# EAGLE design Maxim 7219 LED display - Sparkfun YoungSun 4 digit 7 segment CA v.1.1 (EAGLE 6.5.0)
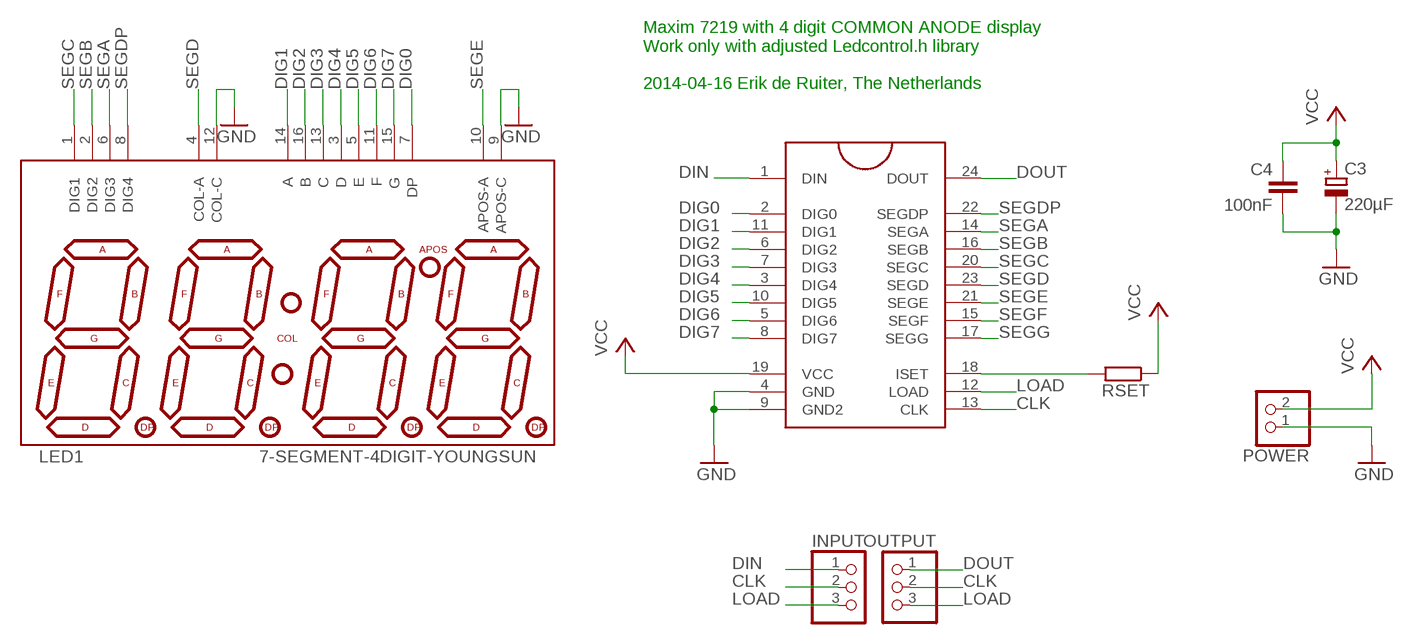
[diagram p0: schematic, sheet 1]

## Parts
C3  220µF  CPOL-EUE3.5-8  [E3,5-8]
C4  100nF  C-EU050-025X075  [C050-025X075]
INPUT  PINHD-1X3  [1X03]
LED1  7-SEGMENT-4DIGIT-YOUNGSUN  [7-SEGMENT-4DIGIT-YOUNGSUN]
OUTPUT  PINHD-1X3  [1X03]
POWER  PINHD-1X2  [1X02]
RSET  R-EU_0207/10  [0207/10]
U$3  MAX7219DIP  [DIL24]

## Nets
CLK: INPUT.2 OUTPUT.2 U$3.13(CLK)
DIG0: LED1.7(DP) U$3.2(DIG0)
DIG1: LED1.14(A) U$3.11(DIG1)
DIG2: LED1.16(B) U$3.6(DIG2)
DIG3: LED1.13(C) U$3.7(DIG3)
DIG4: LED1.3(D) U$3.3(DIG4)
DIG5: LED1.5(E) U$3.10(DIG5)
DIG6: LED1.11(F) U$3.5(DIG6)
DIG7: LED1.15(G) U$3.8(DIG7)
DIN: INPUT.1 U$3.1(DIN)
DOUT: OUTPUT.1 U$3.24(DOUT)
GND: C3.- C4.2 LED1.9(APOS-C) LED1.12(COL-C) POWER.1 U$3.4(GND) U$3.9(GND2)
LOAD: INPUT.3 OUTPUT.3 U$3.12(LOAD)
N$9: RSET.2 U$3.18(ISET)
SEGA: LED1.6(DIG3) U$3.14(SEGA)
SEGB: LED1.2(DIG2) U$3.16(SEGB)
SEGC: LED1.1(DIG1) U$3.20(SEGC)
SEGD: LED1.4(COL-A) U$3.23(SEGD)
SEGDP: LED1.8(DIG4) U$3.22(SEGDP)
SEGE: LED1.10(APOS-A) U$3.21(SEGE)
SEGF: U$3.15(SEGF)
SEGG: U$3.17(SEGG)
VCC: C3.+ C4.1 POWER.2 RSET.1 U$3.19(VCC)

## Notes on the sheet
- Maxim 7219 with 4 digit COMMON ANODE display
  Work only with adjusted Ledcontrol.h library
  
  2014-04-16 Erik de Ruiter, The Netherlands

## Library data of the parts
C3 = rcl:CPOL-EU: POLARIZED CAPACITOR, European symbol
C4 = rcl:C-EU: CAPACITOR, European symbol
INPUT OUTPUT = pinhead:PINHD-1X3: PIN HEADER
LED1 = SparkFun-Displays:7-SEGMENT-4DIGIT-YOUNGSUN: This is a part for the 4-Digit 7-segment LEDs from Young Sun. Different from the Digikey LEDs, all 16 pins are used. The LONGPADS Variant is used for a test jig, but you may like it because there is more pad to solder to. If you are concerned about routing space, the standard works just fine though.
POWER = pinhead:PINHD-1X2: PIN HEADER
RSET = rcl:R-EU_: RESISTOR, European symbol
U$3 = SparkFun-DigitalIC:MAX7219: 8-digit, 8-segment LED display driver, serial input

## Board
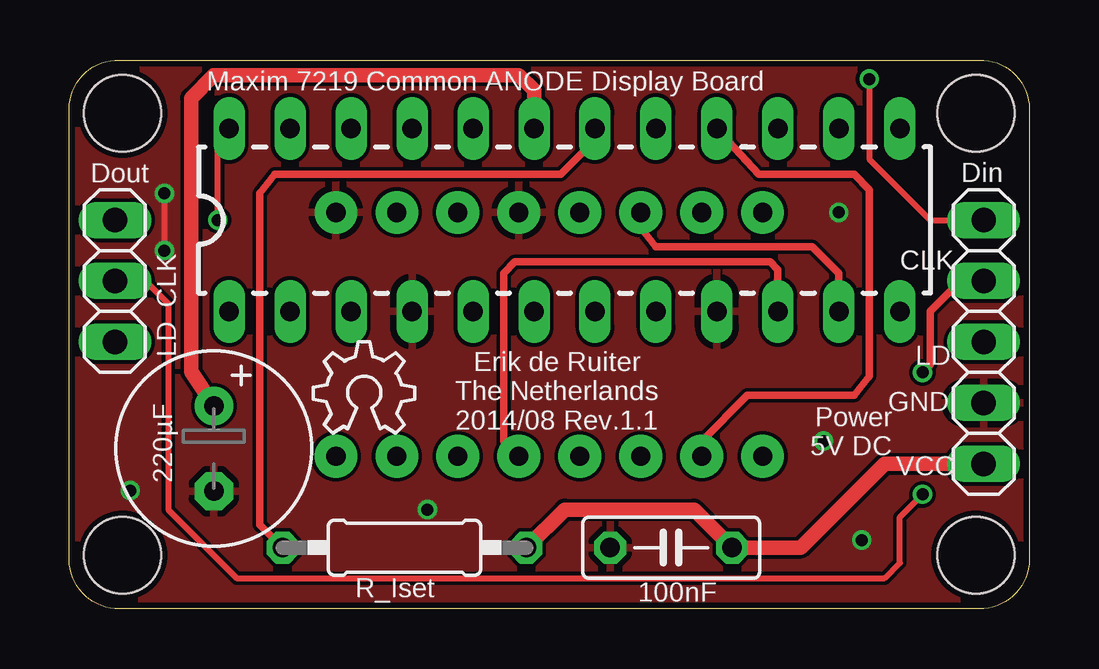
[diagram p1: board, top side]
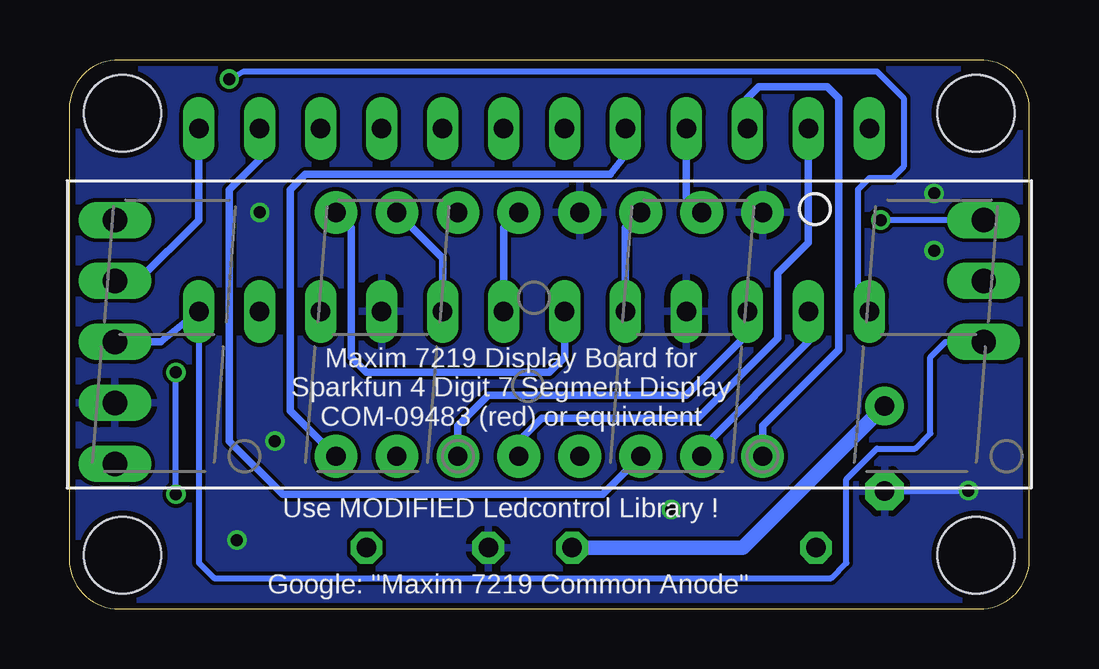
[diagram p2: board, bottom side, seen from below]

Size 40.02 x 22.86 mm. Coordinates in mm from the lower left corner, seen from the top.
Outline: 0.01,20.64 arc-90 1.91,22.86 38.11,22.86 arc-90 40.01,20.64 40.01,2.22 arc-90 38.11,0 1.91,0 arc-90 0.01,2.22 0.01,20.64
Copper layers (1*16): Top 0.035mm / dielectric 1.5mm / Bottom 0.035mm
Design rules "ITEADstudio_DRC": minimum track width 6mil, minimum drill 12mil, track to track 6mil, track to pad 6mil, pad to pad 6mil, via to via 6mil, smd to smd 0mil, copper to edge 10mil, drill to drill 10mil, minimum pad ring 10mil, minimum via ring 6mil, stop-mask expansion 2mil, vias tented up to drill 100mil, thermal gap 10mil
Holes 3.2 mm at 37.79,2.22 2.23,2.22 37.79,20.64 2.23,20.64

### Footprints (pad centres in the part's own frame; a part is rotated, then mirrored left to right if it is on the bottom)
E3,5-8 = drill 0.813 pad 1.6: + -1.778,0 | drill 0.813 pad 1.6 octagon: - 1.778,0
C050-025X075 = drill 0.813 octagon: 1 -2.54,0; 2 2.54,0
1X03 = drill 1.016 long: 1 -2.54,0; 2 0,0; 3 2.54,0
7-SEGMENT-4DIGIT-YOUNGSUN = drill 0.8 pad 1.778: 1 -8.89,-5.08; 2 -6.35,-5.08; 3 -3.81,-5.08; 4 -1.27,-5.08; 5 1.27,-5.08; 6 3.81,-5.08; 7 6.35,-5.08; 8 8.89,-5.08; 9 8.89,5.08; 10 6.35,5.08; 11 3.81,5.08; 12 1.27,5.08; 13 -1.27,5.08; 14 -3.81,5.08; 15 -6.35,5.08; 16 -8.89,5.08
1X02 = drill 1.016 long: 1 -1.27,0; 2 1.27,0
0207/10 = drill 0.813 octagon: 1 -5.08,0; 2 5.08,0
DIL24 = drill 0.813 long: 1 -13.97,-3.81; 2 -11.43,-3.81; 3 -8.89,-3.81; 4 -6.35,-3.81; 5 -3.81,-3.81; 6 -1.27,-3.81; 7 1.27,-3.81; 8 3.81,-3.81; 9 6.35,-3.81; 10 8.89,-3.81; 11 11.43,-3.81; 12 13.97,-3.81; 13 13.97,3.81; 14 11.43,3.81; 15 8.89,3.81; 16 6.35,3.81; 17 3.81,3.81; 18 1.27,3.81; 19 -1.27,3.81; 20 -3.81,3.81; 21 -6.35,3.81; 22 -8.89,3.81; 23 -11.43,3.81; 24 -13.97,3.81

### Placement (x,y rotation side)
C3  6.03,6.67 270 top
C4  25.09,2.54 180 top
INPUT  38.11,13.65 270 top
LED1  20.01,11.43 0 bottom
OUTPUT  1.91,13.65 270 top
POWER  38.11,7.3 270 top
RSET  13.98,2.54 180 top
U$2  [OSHW_6X150_NOTEXT]  10.17,7.3 0 top
U$3  20.64,16.19 0 top

### Tracks (layer width: path | path; a pad name or v marks a point on that pad's centre or on a via)
CLK  (via drill 0.5)
  Top 0.254: OUTPUT.2 3.18,13.65 4.13,12.7 4.13,4.13 6.99,1.27 33.98,1.27 34.61,1.9 34.61,3.81 v35.57,4.76
  Top 0.305: v35.57,9.84 35.88,10.16 35.88,12.38 37.15,13.65 INPUT.2
  Bottom 0.254: v35.57,4.76 v35.57,9.84
  Bottom 0.305: U$3.13 34.61,16.19 37.15,13.65 INPUT.2
DIG0
  Bottom 0.305: U$3.2 9.21,11.11 13.66,6.67 LED1.7
DIG1
  Top 0.305: U$3.11 32.07,13.97 30.96,15.08 24.45,15.08 23.82,15.88 LED1.14
DIG2
  Bottom 0.305: U$3.6 19.37,10.48 20.01,9.84 27.63,9.84 28.26,10.48 28.26,15.88 LED1.16
DIG3
  Bottom 0.305: U$3.7 21.91,15.88 LED1.13
DIG4
  Bottom 0.305: U$3.3 11.75,11.43 14.29,8.89 22.55,8.89 23.82,7.62 LED1.3
DIG5
  Top 0.305: LED1.5 18.1,6.99 18.1,13.97 18.58,14.45 29.22,14.45 29.53,14.13 U$3.10
DIG6
  Bottom 0.305: LED1.11 16.83,15.88 U$3.5
DIG7
  Bottom 0.305: U$3.8 24.45,14.6 LED1.15
DIN  (via drill 0.5)
  Top 0.254: v33.34,22.07 33.34,18.73 35.88,16.19 INPUT.1
  Bottom 0.254: v33.34,22.07 32.71,22.38 6.36,22.38 5.24,21.27 5.24,18.41 5.72,17.94 6.67,17.94 7.15,17.46 7.15,12.7 U$3.1
DOUT  (via drill 0.5)
  Top 0.254: v6.2,16.19 6.2,19.37 6.67,19.84 U$3.24
  Bottom 0.254: OUTPUT.1 v6.2,16.19
GND  (via drill 0.5)
  Top 0.254: v3.97,17.3 v3.97,14.92
  Bottom 0.254: 6.04,4.92 v2.55,4.92
  other vias: 31.44,6.99 32.07,16.51 14.93,4.13 33.03,2.86
  pour Bottom: 0.01,23.18 40.01,23.18 40.01,0 0.01,0
  pour Top: 0.01,23.18 40.01,23.18 40.01,0 0.01,0
LOAD
  Bottom 0.254: U$3.12 34.61,1.9 33.98,1.27 8.26,1.27 7.63,1.9 7.63,5.4 6.36,6.67 4.77,6.67 4.13,7.3 4.13,10.48 3.5,11.11 OUTPUT.3
  Bottom 0.305: INPUT.3 36.2,11.11 U$3.12
N$9
  Top 0.305: U$3.18 21.91,19.53 20.48,18.1 8.58,18.1 7.94,17.3 7.94,3.49 RSET.2
SEGA
  Bottom 0.305: U$3.14 32.07,18.73 33.34,17.46 33.34,6.99 31.12,4.76 17.79,4.76 LED1.6
SEGB
  Top 0.305: U$3.16 28.74,18.1 32.71,18.1 33.34,17.46 33.34,9.68 32.71,8.89 28.26,8.89 26.36,6.99 LED1.2
SEGC
  Bottom 0.305: U$3.20 16.83,18.89 17.47,18.1 30.17,18.1 30.8,17.46 30.8,8.25 LED1.1
SEGD
  Bottom 0.305: U$3.23 9.21,15.24 10.48,13.97 10.48,11.27 13.82,7.94 20.33,7.94 21.28,6.99 LED1.4
SEGDP
  Bottom 0.305: LED1.8 11.12,7.62 7.94,10.8 7.94,21.27 8.42,21.75 11.28,21.75 11.75,21.27 U$3.22
SEGE
  Bottom 0.305: U$3.21 14.29,17.15 LED1.10
VCC
  Top 0.61: U$3.19 19.37,21.59 18.74,22.22 6.04,22.22 5.09,21.27 5.09,9.87 C3.+ | RSET.1 20.64,4.13 26.04,4.13 C4.1 30.49,2.54 33.98,6.03 POWER.2
  Bottom 0.61: RSET.1 11.94,2.54 C3.+

### Text on the board
tPlace: Maxim 7219 Common ANODE Display Board | Dout | Din | CLK | CLK | LD | LD | GND | Power / 5V DC | Erik de Ruiter / The Netherlands / 2014/08 Rev.1.1 | VCC | 220µF | 100nF | R_Iset
bNames: Maxim 7219 Display Board for / Sparkfun 4 Digit 7 Segment Display / COM-09483 (red) or equivalent | Use MODIFIED Ledcontrol Library ! | Google: "Maxim 7219 Common Anode"
Reference: APOS_K | APOS_A | F | COL_K | C | A | G | B | 4 | DP | 3 | E | COL_A | D | 2 | 1